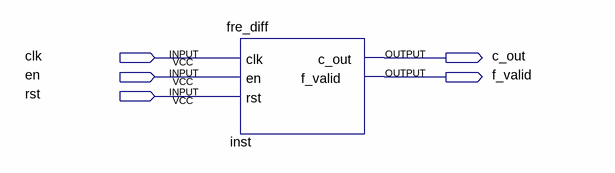
[diagram p0: schematic sheet]
// Quartus schematic Block4.bdf as structural Verilog: 1 symbols, 5 pins
module Block4 (
  input  clk,
  input  en,
  input  rst,
  output c_out,
  output f_valid
);

  fre_diff inst (.clk(clk), .en(en), .rst(rst), .c_out(c_out), .f_valid(f_valid));
endmodule
